# EAGLE schematic schematic (EAGLE 7.2.0)
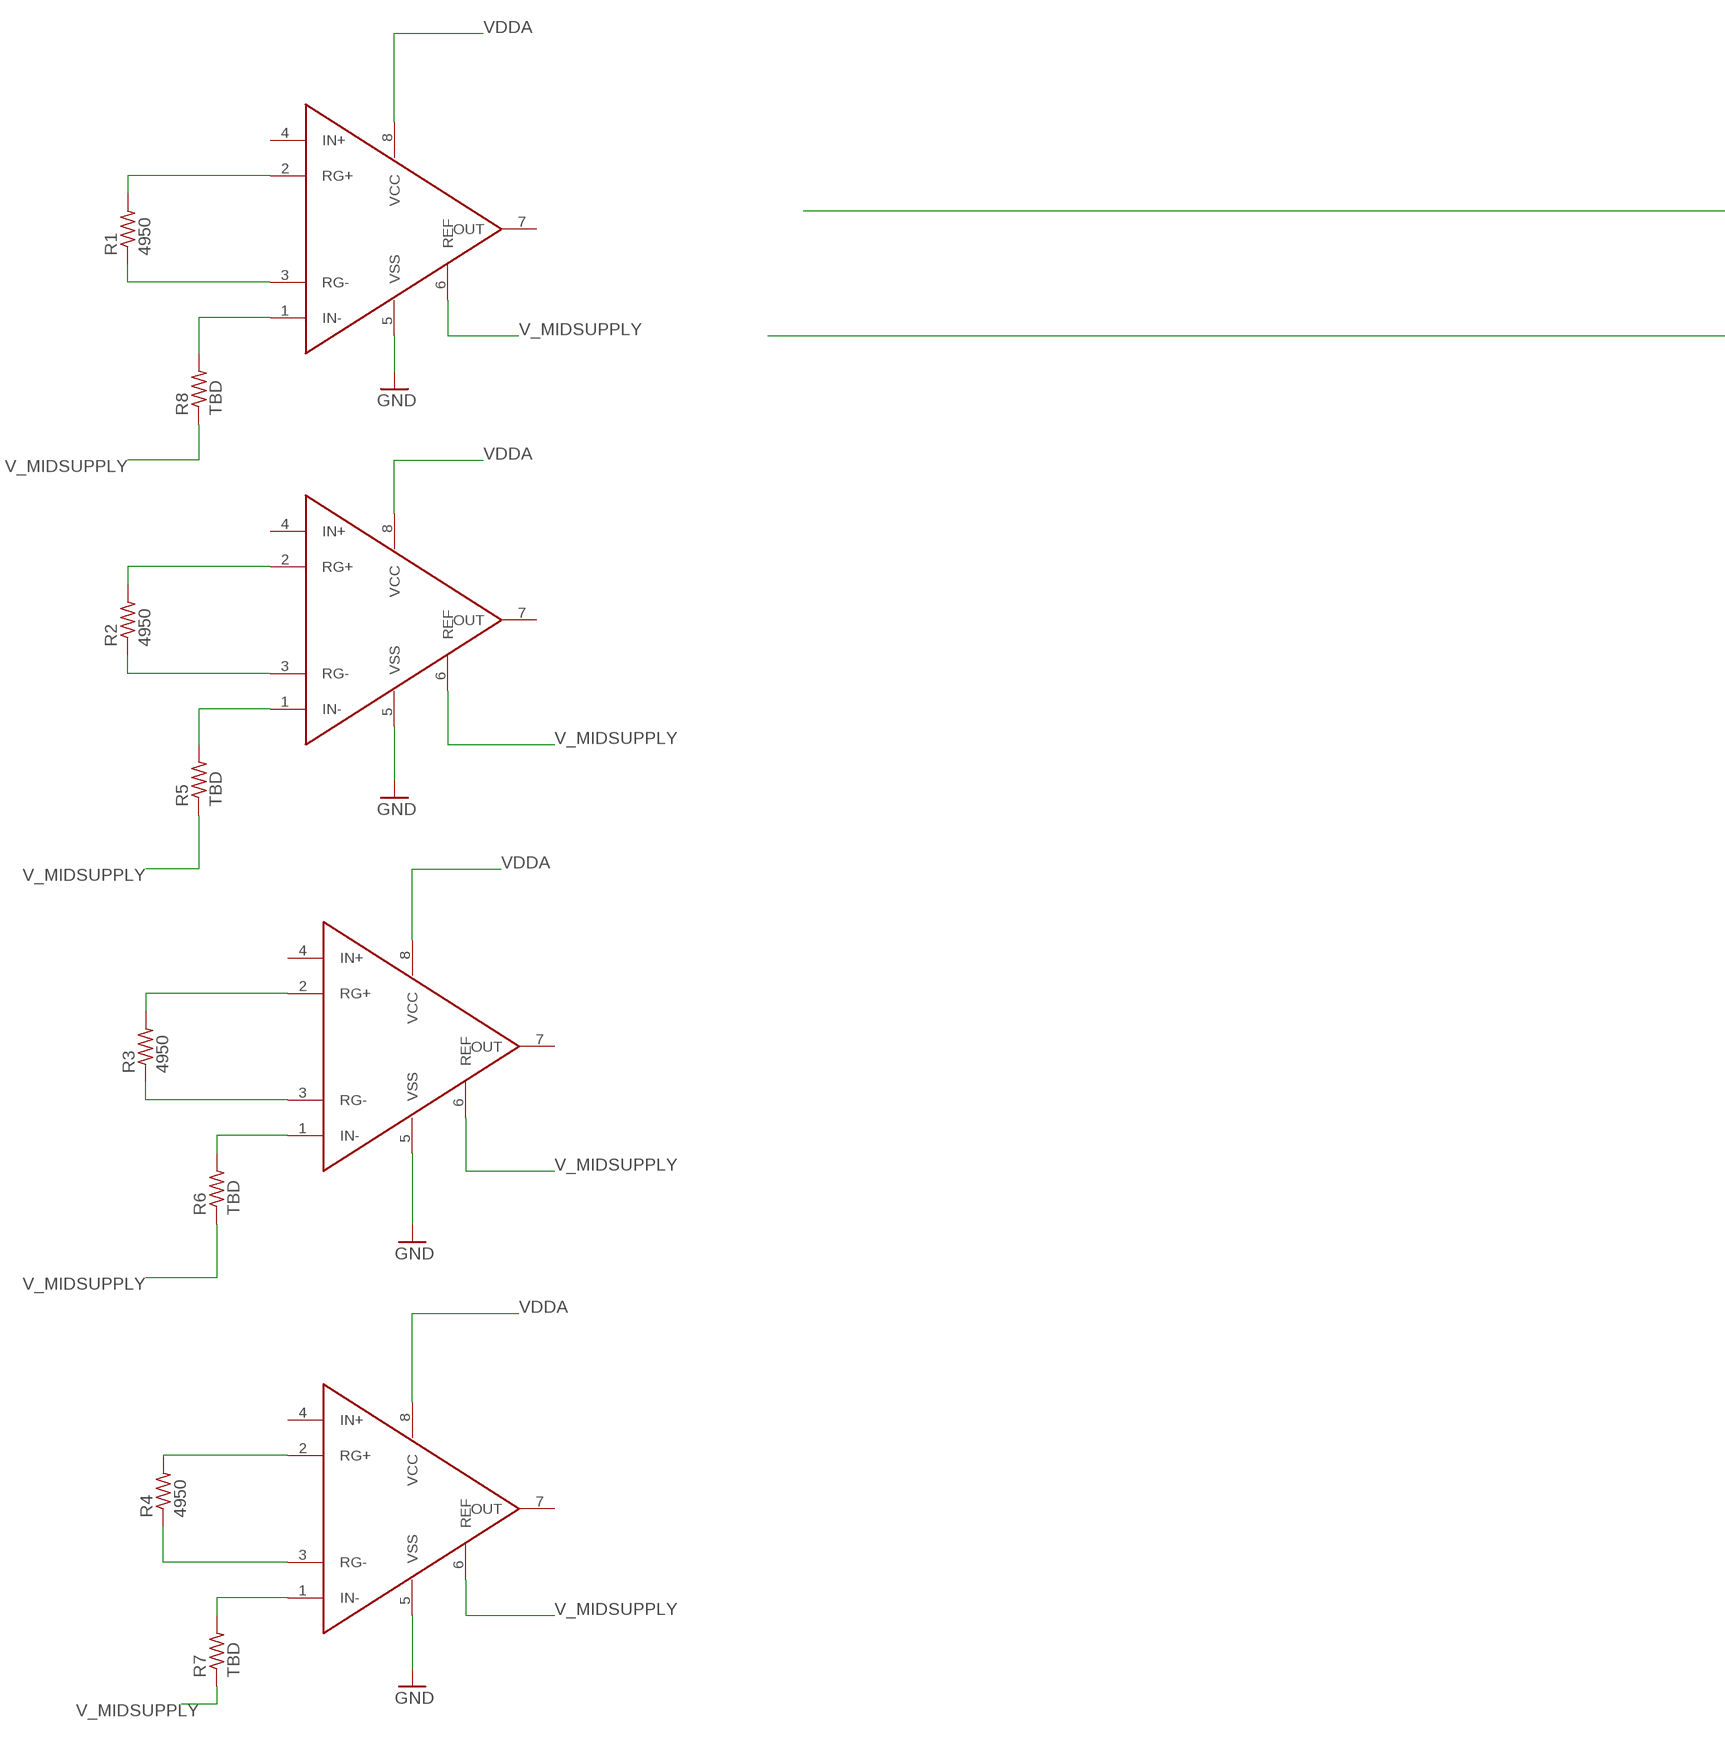
[diagram p0: schematic, sheet 1, part 1 of 2]
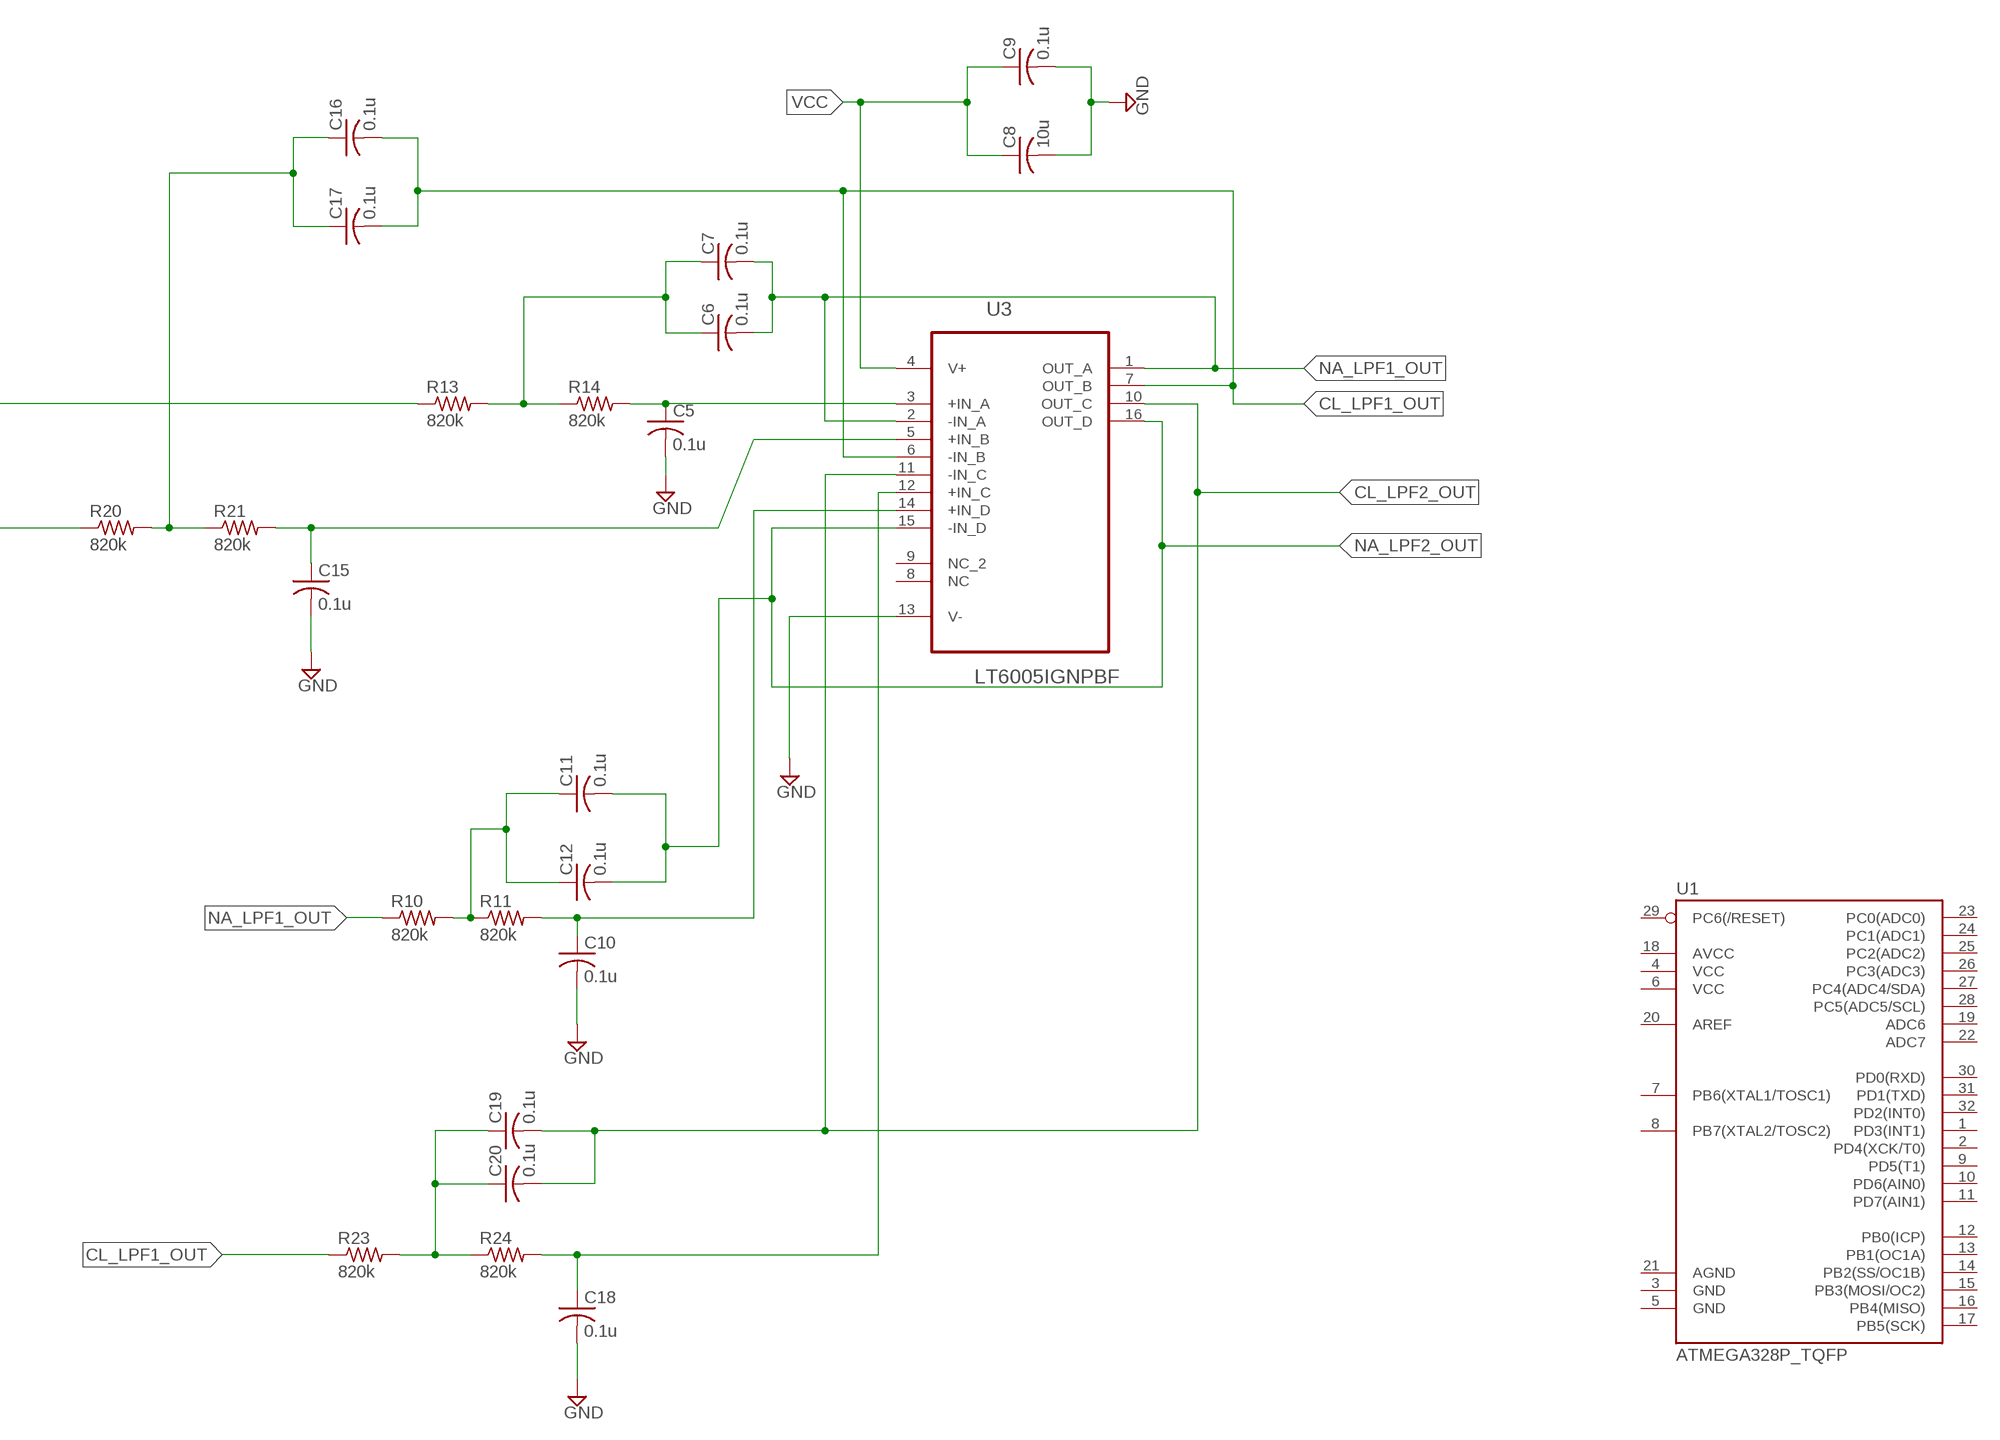
[diagram p1: schematic, sheet 1, part 2 of 2]

## Parts
C5  0.1u  C-USC0201  [C0201]
C6  0.1u  C-USC0201  [C0201]
C7  0.1u  C-USC0201  [C0201]
C8  10u  C-USC0402  [C0402]
C9  0.1u  C-USC0201  [C0201]
C10  0.1u  C-USC0201  [C0201]
C11  0.1u  C-USC0201  [C0201]
C12  0.1u  C-USC0201  [C0201]
C15  0.1u  C-USC0201  [C0201]
C16  0.1u  C-USC0201  [C0201]
C17  0.1u  C-USC0201  [C0201]
C18  0.1u  C-USC0201  [C0201]
C19  0.1u  C-USC0201  [C0201]
C20  0.1u  C-USC0201  [C0201]
R1  4950  R-US_R0201  [R0201]
R2  4950  R-US_R0201  [R0201]
R3  4950  R-US_R0201  [R0201]
R4  4950  R-US_R0201  [R0201]
R5  TBD  R-US_R0201  [R0201]
R6  TBD  R-US_R0201  [R0201]
R7  TBD  R-US_R0201  [R0201]
R8  TBD  R-US_R0201  [R0201]
R10  820k  R-US_R0201  [R0201]
R11  820k  R-US_R0201  [R0201]
R13  820k  R-US_R0201  [R0201]
R14  820k  R-US_R0201  [R0201]
R20  820k  R-US_R0201  [R0201]
R21  820k  R-US_R0201  [R0201]
R23  820k  R-US_R0201  [R0201]
R24  820k  R-US_R0201  [R0201]
U1  ATMEGA328P_TQFP  [TQFP32-08]
U3  LT6005IGNPBF  [SOP63P600X175-16N]
U$1  SOIC8_INAMPMSOP  [MSOP08]
U$2  SOIC8_INAMPMSOP  [MSOP08]
U$3  SOIC8_INAMPMSOP  [MSOP08]
U$4  SOIC8_INAMPMSOP  [MSOP08]

## Nets
CL_LPF1_OUT: C16.2 C17.2 R23.1 U3.6(-IN_B) U3.7(OUT_B)
CL_LPF2_OUT: C19.2 C20.2 U3.10(OUT_C) U3.11(-IN_C)
GND: C5.2 C8.2 C9.2 C10.2 C15.2 C18.2 U3.13(V-) U$1.5(VSS) U$2.5(VSS) U$3.5(VSS) U$4.5(VSS)
N$1: R3.1 U$3.3(RG-)
N$2: R3.2 U$3.2(RG+)
N$3: R2.2 U$2.2(RG+)
N$4: R2.1 U$2.3(RG-)
N$5: R1.2 U$1.2(RG+)
N$6: R1.1 U$1.3(RG-)
N$7: R4.2 U$4.2(RG+)
N$8: R4.1 U$4.3(RG-)
N$9: R7.2 U$4.1(IN-)
N$10: R6.2 U$3.1(IN-)
N$11: R5.2 U$2.1(IN-)
N$12: R8.2 U$1.1(IN-)
N$13: C5.1 R14.2 U3.3(+IN_A)
N$14: C10.1 R11.2 U3.14(+IN_D)
N$15: C6.1 C7.1 R13.2 R14.1
N$16: R13.1
N$17: C11.1 C12.1 R10.2 R11.1
N$18: R20.1
N$24: C15.1 R21.2 U3.5(+IN_B)
N$25: C16.1 C17.1 R20.2 R21.1
N$26: C18.1 R24.2 U3.12(+IN_C)
N$27: C19.1 C20.1 R23.2 R24.1
NA_LPF1_OUT: C6.2 C7.2 R10.1 U3.1(OUT_A) U3.2(-IN_A)
NA_LPF2_OUT: C11.2 C12.2 U3.15(-IN_D) U3.16(OUT_D)
V_MIDSUPPLY: R5.1 R6.1 R7.1 R8.1 U$1.6(REF) U$2.6(REF) U$3.6(REF) U$4.6(REF)
VCC: C8.1 C9.1 U3.4(V+)
VDDA: U$1.8(VCC) U$2.8(VCC) U$3.8(VCC) U$4.8(VCC)
Unconnected: U1.1(PD3(INT1)) U1.2(PD4(XCK/T0)) U1.3(GND) U1.4(VCC) U1.5(GND) U1.6(VCC) U1.7(PB6(XTAL1/TOSC1)) U1.8(PB7(XTAL2/TOSC2)) U1.9(PD5(T1)) U1.10(PD6(AIN0)) U1.11(PD7(AIN1)) U1.12(PB0(ICP)) U1.13(PB1(OC1A)) U1.14(PB2(SS/OC1B)) U1.15(PB3(MOSI/OC2)) U1.16(PB4(MISO)) U1.17(PB5(SCK)) U1.18(AVCC) U1.19(ADC6) U1.20(AREF) U1.21(AGND) U1.22(ADC7) U1.23(PC0(ADC0)) U1.24(PC1(ADC1)) U1.25(PC2(ADC2)) U1.26(PC3(ADC3)) U1.27(PC4(ADC4/SDA)) U1.28(PC5(ADC5/SCL)) U1.29(PC6(/RESET)) U1.30(PD0(RXD)) U1.31(PD1(TXD)) U1.32(PD2(INT0)) U3.8(NC) U3.9(NC_2) U$1.4(IN+) U$1.7(OUT) U$2.4(IN+) U$2.7(OUT) U$3.4(IN+) U$3.7(OUT) U$4.4(IN+) U$4.7(OUT)

## Library data of the parts
C5-C12 C15-C20 = resistor:C-US: CAPACITOR, American symbol
R1-R8 R10 R11 R13 R14 R20 R21 R23 R24 = resistor:R-US_: RESISTOR, American symbol
U1 = SparkFun-DigitalIC:ATMEGA328P_TQFP; PROD_ID: IC-09069
U3 = LTC_By_element14_Batch_1:LT6005IGNPBF: Op Amps; MPN: LT6005IGN#PBF; OC_FARNELL: 1432099; OC_NEWARK: 57M8943; PACKAGE: SSOP-16; SUPPLIER: Linear Technology
U$1-U$4 = eric-custom:SOIC8_INAMP: Generic single supply instrumentation amplifier for SO8 package. Based off of AD8221 inamp package